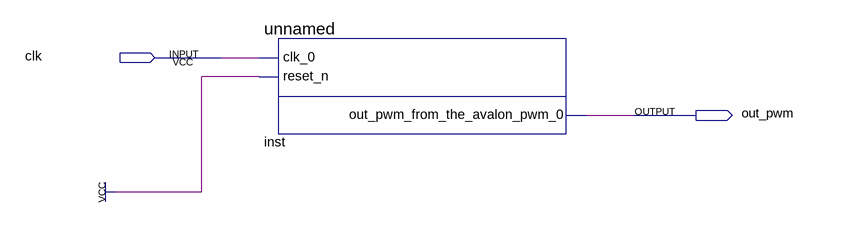
[diagram p0: schematic sheet]
// Quartus schematic sopc_pwm.bdf as structural Verilog: 1 symbols, 2 pins
module sopc_pwm (
  input  clk,
  output out_pwm
);

  unnamed inst (.clk_0(clk), .reset_n(1'b1), .out_pwm_from_the_avalon_pwm_0(out_pwm));
endmodule
